# Altium schematic sheet Sheet1.SchDoc
size A3
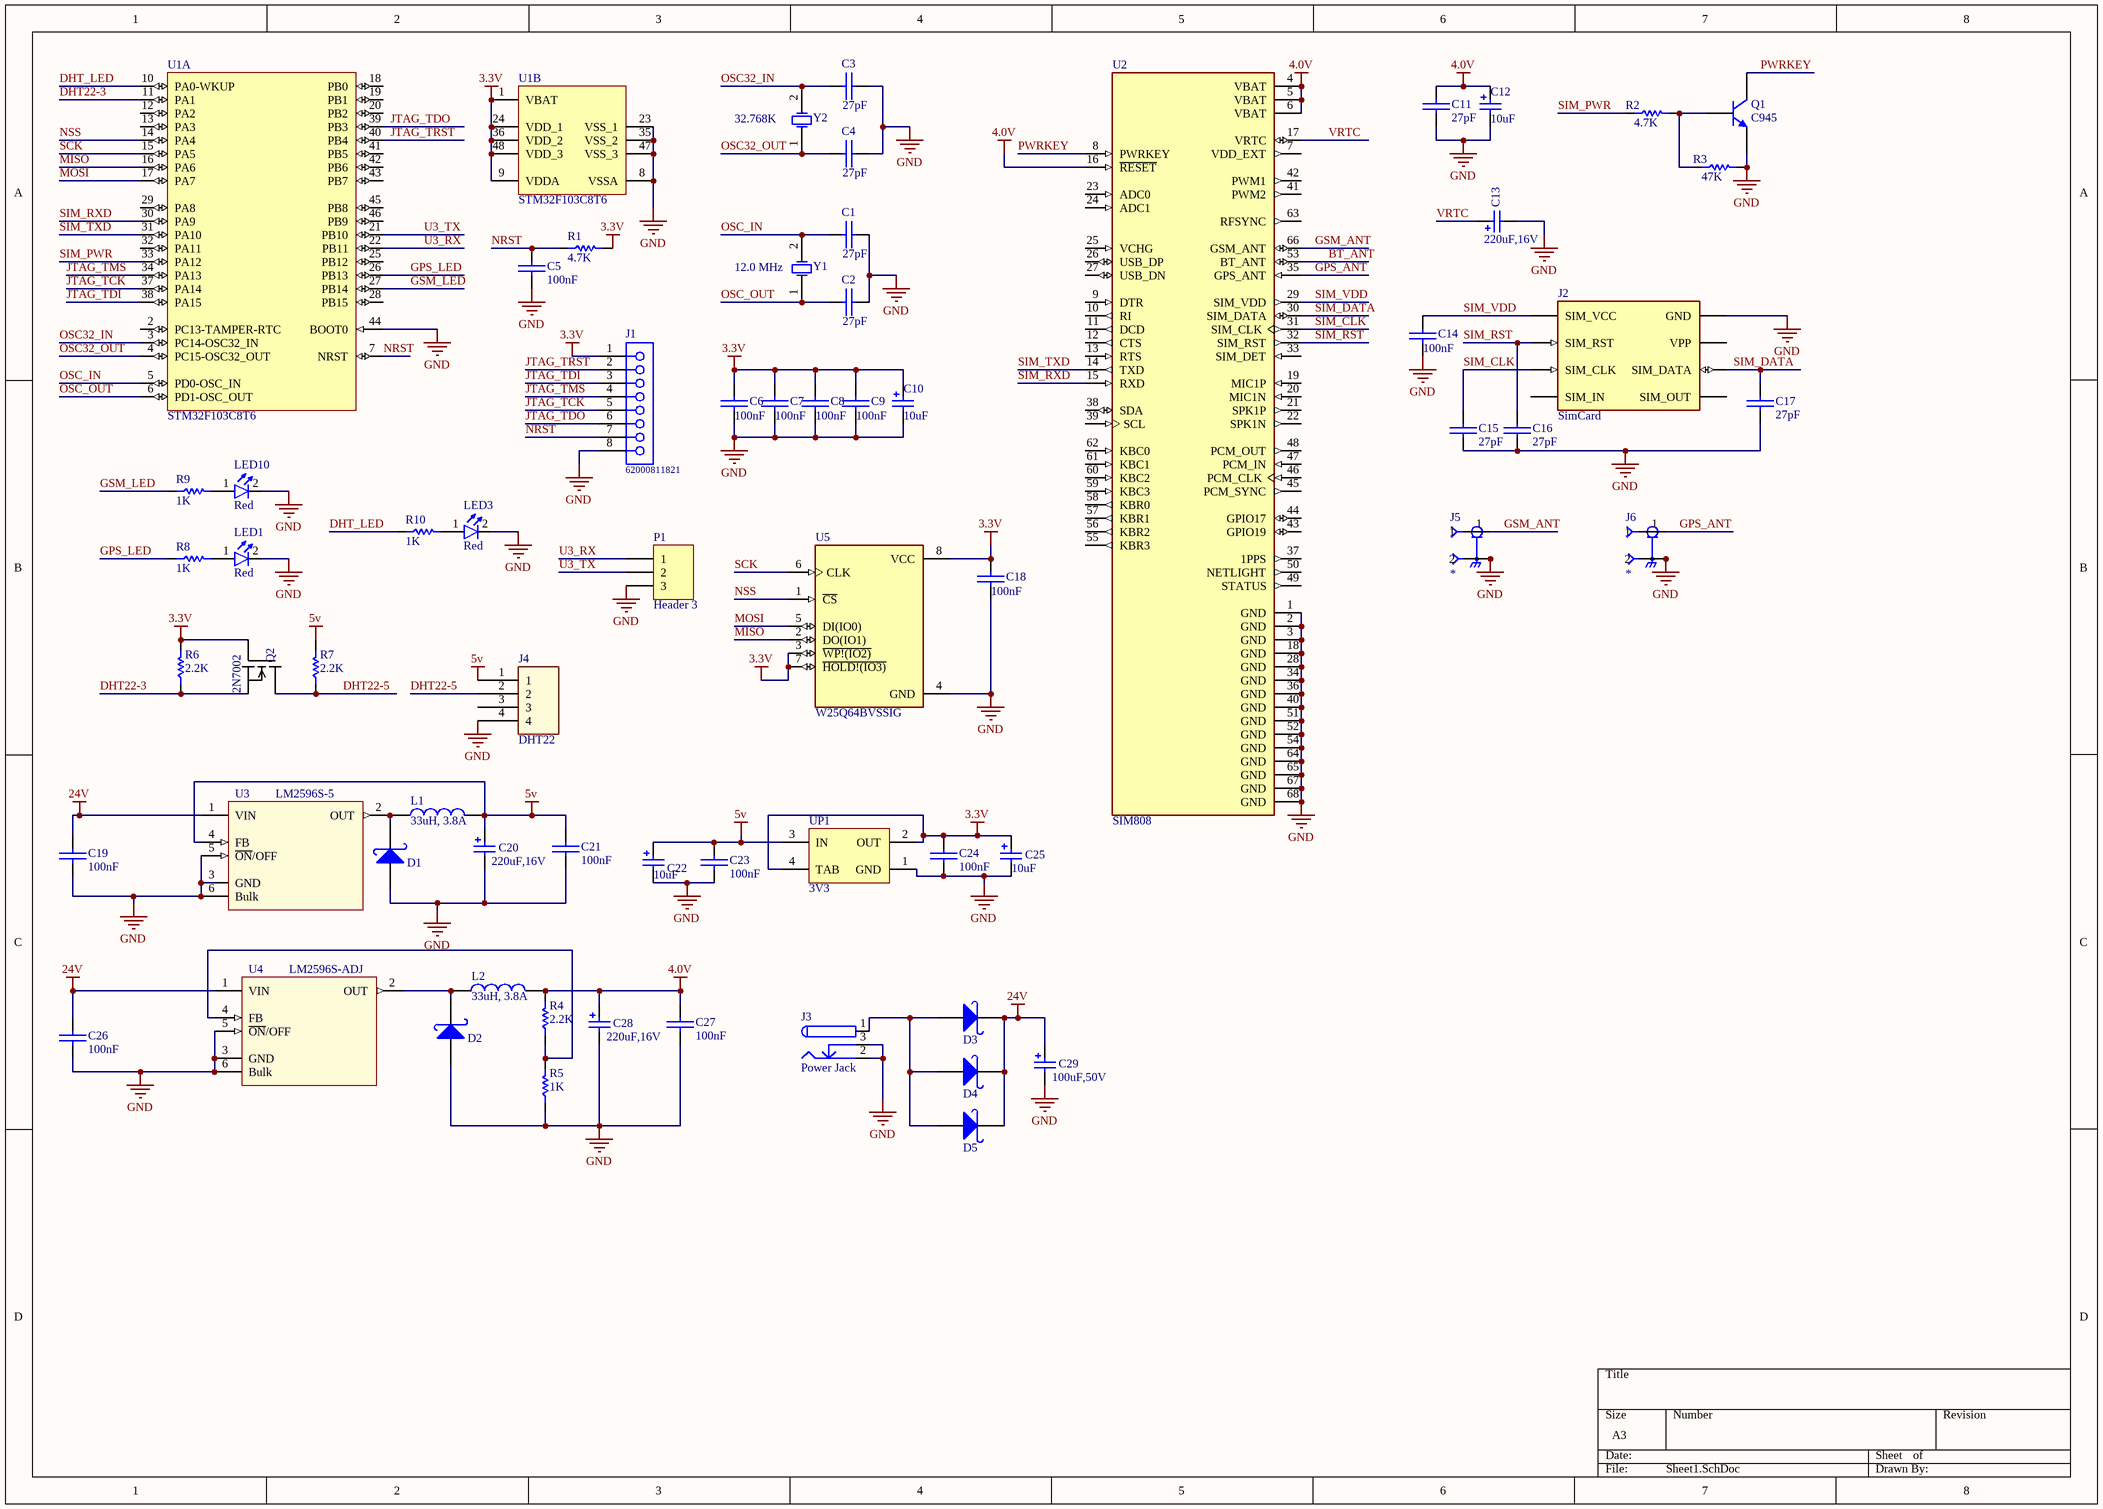
[diagram p0: Sheet1.SchDoc]

## Parts
C1  27pF  [SMD_CAP_0805]
C2  27pF  [SMD_CAP_0805]
C3  27pF  [SMD_CAP_0805]
C4  27pF  [SMD_CAP_0805]
C5  100nF  [SMD_CAP_0805]
C6  100nF  [SMD_CAP_0805]
C7  100nF  [SMD_CAP_0805]
C8  100nF  [SMD_CAP_0805]
C9  100nF  [SMD_CAP_0805]
C10  10uF  [WCAP-AS5H_4x5.5]
C11  27pF  [SMD_CAP_0805]
C12  10uF  [WCAP-AS5H_4x5.5]
C13  220uF,16V  [WCAP-AS5H_6.3x7.7]
C14  100nF  [SMD_CAP_0805]
C15  27pF  [SMD_CAP_0805]
C16  27pF  [SMD_CAP_0805]
C17  27pF  [SMD_CAP_0805]
C18  100nF  [SMD_CAP_0805]
C19  100nF  [SMD_CAP_0805]
C20  220uF,16V  [WCAP-AS5H_6.3x7.7]
C21  100nF  [SMD_CAP_0805]
C22  10uF  [WCAP-AS5H_4x5.5]
C23  100nF  [SMD_CAP_0805]
C24  100nF  [SMD_CAP_0805]
C25  10uF  [WCAP-AS5H_4x5.5]
C26  100nF  [SMD_CAP_0805]
C27  100nF  [SMD_CAP_0805]
C28  220uF,16V  [WCAP-AS5H_6.3x7.7]
C29  100uF,50V  [WCAP-AS5H_8x10.5]
D1  1n5822  [Diode 1N4007 SMD]  (value not drawn)
D2  1n5822  [Diode 1N4007 SMD]  (value not drawn)
D3  1n5822  [Diode 1N4007 SMD]  (value not drawn)
D4  1n5822  [Diode 1N4007 SMD]  (value not drawn)
D5  1n5822  [Diode 1N4007 SMD]  (value not drawn)
J1  62000811821  [62000811821]
J2  SimCard  [SImCArd]
J3  Power Jack  [Power Jack]
J4  DHT22  [XH-12-Right]
J5  221790-1  [TE_221790-1]  (value not drawn)
J6  221790-1  [TE_221790-1]  (value not drawn)
L1  33uH, 3.8A  [WE-PD_1210]
L2  33uH, 3.8A  [WE-PD_1210]
LED1  Red  [LED-3mm]
LED3  Red  [LED-3mm]
LED10  Red  [LED-3mm]
P1  Header 3  [HDR1X3]
Q1  C945  [SOT23_N]
Q2  2N7002  [*SOT23]
R1  4.7K  [RES 0805 (2012X06L)]
R2  4.7K  [RES 0805 (2012X06L)]
R3  47K  [RES 0805 (2012X06L)]
R4  2.2K  [RES 0805 (2012X06L)]
R5  1K  [RES 0805 (2012X06L)]
R6  2.2K  [RES 0805 (2012X06L)]
R7  2.2K  [RES 0805 (2012X06L)]
R8  1K  [RES 0805 (2012X06L)]
R9  1K  [RES 0805 (2012X06L)]
R10  1K  [RES 0805 (2012X06L)]
U1  STM32F103C8T6  [STM-LQFP48_N]  (parts A,B of 2)
U2  SIM808  [XCVR_SIM808]
U3  LM2596S-5  [*TO170P1435X465-6N]
U4  LM2596S-ADJ  [*TO170P1435X465-6N]
U5  W25Q64BVSSIG  [SOIC127P790X216-8N]
UP1  3V3  [SOT223]
Y1  12.0 MHz  [Crystal SMD]
Y2  32.768K  [XTAL RTC]

## Nets
3.3V: C6.1(+) C7.1(+) C8.1(+) C9.1(+) C10.2(P) C18.1(+) C24.1(+) C25.2(P) J1.1 Q2.1(G) R1.2 R6.2 U1.1(VBAT) U1.9(VDDA) U1.24(VDD_1) U1.36(VDD_2) U1.48(VDD_3) U5.3(~{WP!(IO2)}) U5.7(~{HOLD!(IO3)}) U5.8(VCC) UP1.2(OUT) UP1.4(TAB)
4.0V: C11.2(-) C12.2(P) C27.1(+) C28.2(P) L2.2 R4.2 U2.4(VBAT) U2.5(VBAT) U2.6(VBAT) U2.16(~{RESET})
5v: C20.2(P) C21.1(+) C22.2(P) C23.1(+) J4.1 L1.2 R7.2 U3.4(FB) UP1.3(IN)
24V: C19.1(+) C26.1(+) C29.2(P) D3.2(K) D4.2(K) D5.2(K) U3.1(VIN) U4.1(VIN)
GND: C1.2(-) C2.2(-) C3.2(-) C4.2(-) C5.2(-) C6.2(-) C7.2(-) C8.2(-) C9.2(-) C10.1(N) C11.1(+) C12.1(N) C13.1(N) C14.2(-) C15.1(+) C16.1(+) C17.1(+) C18.2(-) C19.2(-) C20.1(N) C21.2(-) C22.1(N) C23.2(-) C24.2(-) C25.1(N) C26.2(-) C27.2(-) C28.1(N) C29.1(N) D1.1(A) D2.1(A) J1.8 J2.C5(GND) J3.2 J3.3 J4.4 J5.2 J5.3 J5.4 J5.5 J6.2 J6.3 J6.4 J6.5 LED1.2(K) LED3.2(K) LED10.2(K) P1.3 Q1.2(E) R3.2 R5.1 U1.8(VSSA) U1.23(VSS_1) U1.35(VSS_2) U1.44(BOOT0) U1.47(VSS_3) U2.1(GND) U2.2(GND) U2.3(GND) U2.18(GND) U2.28(GND) U2.34(GND) U2.36(GND) U2.40(GND) U2.51(GND) U2.52(GND) U2.54(GND) U2.64(GND) U2.65(GND) U2.67(GND) U2.68(GND) U3.3(GND) U3.5(~{ON}/OFF) U3.6(Bulk) U4.3(GND) U4.5(~{ON}/OFF) U4.6(Bulk) U5.4(GND) UP1.1(GND)
BT_ANT: U2.53(BT_ANT)
DHT22-3: Q2.2(S) R6.1 U1.11(PA1)
DHT22-5: J4.2 Q2.3(D) R7.1
DHT_LED: R10.1 U1.10(PA0-WKUP)
GPS_ANT: J6.1 U2.35(GPS_ANT)
GPS_LED: R8.1 U1.26(PB13)
GSM_ANT: J5.1 U2.66(GSM_ANT)
GSM_LED: R9.1 U1.27(PB14)
JTAG_TCK: J1.5 U1.37(PA14)
JTAG_TDI: J1.3 U1.38(PA15)
JTAG_TDO: J1.6 U1.39(PB3)
JTAG_TMS: J1.4 U1.34(PA13)
JTAG_TRST: J1.2 U1.40(PB4)
MISO: U1.16(PA6) U5.2(DO(IO1))
MOSI: U1.17(PA7) U5.5(DI(IO0))
NRST: C5.1(+) J1.7 R1.1 U1.7(NRST)
NSS: U1.14(PA4) U5.1(~{CS})
OSC32_IN: C3.1(+) U1.3(PC14-OSC32_IN) Y2.2(OSC2)
OSC32_OUT: C4.1(+) U1.4(PC15-OSC32_OUT) Y2.1(OSC1)
OSC_IN: C1.1(+) U1.5(PD0-OSC_IN) Y1.2(OSC2)
OSC_OUT: C2.1(+) U1.6(PD1-OSC_OUT) Y1.1(OSC1)
PWRKEY: Q1.3(C) U2.8(PWRKEY)
SCK: U1.15(PA5) U5.6(CLK)
SIM_CLK: C15.2(-) J2.C3(SIM_CLK) U2.31(SIM_CLK)
SIM_DATA: C17.2(-) J2.C7(SIM_DATA) U2.30(SIM_DATA)
SIM_PWR: R2.1 U1.33(PA12)
SIM_RST: C16.2(-) J2.C2(SIM_RST) U2.32(SIM_RST)
SIM_RXD: U1.30(PA9) U2.15(RXD)
SIM_TXD: U1.31(PA10) U2.14(TXD)
SIM_VDD: C14.1(+) J2.C1(SIM_VCC) U2.29(SIM_VDD)
U3_RX: P1.1 U1.22(PB11)
U3_TX: P1.2 U1.21(PB10)
VRTC: C13.2(P) U2.17(VRTC)
NetD1_2: D1.2(K) L1.1 U3.2(OUT)
NetD2_2: D2.2(K) L2.1 U4.2(OUT)
NetD3_1: D3.1(A) D4.1(A) D5.1(A) J3.1
NetLED1_1: LED1.1(A) R8.2
NetLED3_1: LED3.1(A) R10.2
NetLED10_1: LED10.1(A) R9.2
NetQ1_1: Q1.1(B) R2.2 R3.1
NetR4_1: R4.1 R5.2 U4.4(FB)

Not connected (* = marked no-connect by the designer): J2 C4(SIM_IN) C6(VPP) C8(SIM_OUT); J4 3; U1 2(PC13-TAMPER-RTC) 12(PA2) 13(PA3) 18(PB0) 19(PB1) 20(PB2) 25(PB12) 28(PB15) 29(PA8) 32(PA11) 41(PB5) 42(PB6) 43(PB7) 45(PB8) 46(PB9); U2 7(VDD_EXT) 9(DTR) 10(RI) 11(DCD) 12(CTS) 13(RTS) 19(MIC1P) 20(MIC1N) 21(SPK1P) 22(SPK1N) 23(ADC0) 24(ADC1) 25(VCHG) 26(USB_DP) 27(USB_DN) 33(SIM_DET) 37(1PPS) 38(SDA) 39(SCL) 41(PWM2) 42(PWM1) 43(GPIO19) 44(GPIO17) 45(PCM_SYNC) 46(PCM_CLK) 47(PCM_IN) 48(PCM_OUT) 49(STATUS) 50(NETLIGHT) 55(KBR3) 56(KBR2) 57(KBR1) 58(KBR0) 59(KBC3) 60(KBC2) 61(KBC1) 62(KBC0) 63(RFSYNC)

## Library data of the parts
C1-C9 C11 C14-C19 C21 C23 C24 C26 C27 = Cap-Bipolar: Bipolar Capacitor; Voltage: 100V; Designer: Saeid Jorablo; Organazation: ControTec; Adding Date: 1387/12/20
  C1-C4 C11 C15-C17: Value: 27pF
  C5-C9 C14 C18 C19 C21 C23 C24 C26 C27: Value: 100nF
C10 C12 C22 C25 = 865230140001: WCAP-AS5H SMT Aluminum Electrolytic Capacitors, D4mm x L5.5mm, 22uF, +/-20%, 6.3VDC; Dissipation Factor: 32%; Endurance: 5000h; Leakage Current: 3uA; Ripple Current max.: 22mA; Technical Reference: ASDB055220M6R3DVCTAE000; ComponentLink1Description: Manufacturer; ComponentLink1URL: http://www.we-online.de; ComponentLink2Description: Datasheet; ComponentLink2URL: https://katalog.we-online.com/pbs/datasheet/865230140001.pdf; Length: 5.5mm; Mounting Technology: SMT; Operating Temperature: -40 to +105degC; Packaging: Tape and Reel; Published Date: August 2019; Capacitance: 22uF; Diameter: 4mm; Part Number: 865230140001; Publisher: Wurth Elektronik; Capacitance Tolerance: +/-20%; Rated Voltage: 6.3VDC
C13 C20 C28 = 865230345005: WCAP-AS5H SMT Aluminum Electrolytic Capacitors, D6.3mm x L7.7mm, 100uF, +/-20%, 16VDC; Dissipation Factor: 22%; Endurance: 5000h; Leakage Current: 16uA; Ripple Current max.: 81mA; Technical Reference: ASDD077101M016DVCTCE000; ComponentLink1Description: Manufacturer; ComponentLink1URL: http://www.we-online.de; ComponentLink2Description: Datasheet; ComponentLink2URL: https://katalog.we-online.com/pbs/datasheet/865230345005.pdf; Length: 7.7mm; Mounting Technology: SMT; Operating Temperature: -40 to +105degC; Packaging: Tape and Reel; Published Date: August 2019; Capacitance: 100uF; Diameter: 6.3mm; Part Number: 865230345005; Publisher: Wurth Elektronik; Capacitance Tolerance: +/-20%; Rated Voltage: 16VDC
C29 = 865230653012: WCAP-AS5H SMT Aluminum Electrolytic Capacitors, D8mm x L10.5mm, 47uF, +/-20%, 50VDC; Dissipation Factor: 12%; Endurance: 5000h; Leakage Current: 23.5uA; Ripple Current max.: 95mA; Technical Reference: ASDE105470M050DVCTEE000; ComponentLink1Description: Manufacturer; ComponentLink1URL: http://www.we-online.de; ComponentLink2Description: Datasheet; ComponentLink2URL: https://katalog.we-online.com/pbs/datasheet/865230653012.pdf; Length: 10.5mm; Mounting Technology: SMT; Operating Temperature: -40 to +105degC; Packaging: Tape and Reel; Published Date: August 2019; Capacitance: 47uF; Diameter: 8mm; Part Number: 865230653012; Publisher: Wurth Elektronik; Capacitance Tolerance: +/-20%; Rated Voltage: 50VDC
D1-D5 = 1N5822 SMD: Schottky Rectifiers; Part. No: SS34; Manufacturer: ON Semiconductor/Fairchild; Designer: Abbas Basereh; Link: https://www.aliexpress.com/item/Free-shipping-100pcs-1n5822-sma-smd-do-214ac-Schottky-diode-ss34/32337482329.html?spm=2114.01010208.3.1.zLZDsP&ws_ab_test=searchweb0_0,searchweb201602_4_10065_10068_10084_10083_10080_10082_10081_10060_10061_10062_10056_10055_10054_10059_10099_10078_10079_427_10073_10103_10102_10096_10052_10050_10051,searchweb201603_4&btsid=6e50dc92-ac69-45bc-a19e-209af19ce602; Link: http://www.tme.eu/en/details/ss34/smd-schottky-diodes/vishay/ss34-e357t/; Link: http://www.digikey.com/product-detail/en/on-semiconductor-fairchild/SS34/SS34FSCT-ND/2094459; Data: 16-12-2016
J1 = 62000811821: WR-PHD Socket Header, THT, pitch 2mm, Single Row, Vertical, 8pin; Pin Number: 8; Gender: Female; Rated Current: 2A; Working Voltage: 250VAC; Withstanding Voltage: 500VAC; Contact Resistance: 20mOhm; ComponentLink1Description: Manufacturer; ComponentLink1URL: http://www.we-online.de; ComponentLink2Description: Datasheet; ComponentLink2URL: https://katalog.we-online.de/em/datasheet/62000811821.pdf; Part Number: 62000811821; Published Date: June 2019; Publisher: Wurth Elektronik; Pitch: 2mm; Operating Temperature: -40 to +105degC; Mounting Technology: THT; Packaging: Tube; Row Number: Single; Orientation: Vertical
J3 = Power Jack: Designer: Saeid Jorablo; Company: Personal; Project Name: Laser; Adding Date: 10/21/2009
J4 = XH-Connector-4pin-right
J5 J6 = 221790-1: Connector; SMA; PCB; Right Angle; Stainless Steel; 0.6 in.; Beryllium Copper; Number_of_Positions: 1; MF: TE Connectivity; Price: None; EU_RoHS_Compliance: Compliant with Exemptions; Package: None; TE_purchase_URL: https://www.te.com/usa-en/product-221790-1.html?te_bu=Cor&te_type=disp&te_campaign=seda_glo_cor-seda-global-disp-prtnr-fy19-seda-model-bom-cta_sma-317_1&elqCampaignId=32493; MP: 221790-1; Value: *; Availability: Unavailable; SnapEDA_Link: https://www.snapeda.com/parts/221790-1/TE%20Connectivity%20AMP%20Connectors/view-part/496294/?ref=snap; Comment_1: *
L1 L2 = 7447709470: WE-PD SMT Power Inductor, size 1210, 47uH, 3.8A; DC Resistance max.: 60mOhm; Self Resonant Frequency: 6.5MHz; Saturation Current: 4.5A; ComponentLink1Description: Manufacturer; ComponentLink1URL: http://www.we-online.de; ComponentLink2Description: Datasheet; ComponentLink2URL: https://katalog.we-online.com/pbs/datasheet/7447709470.pdf; Part Number: 7447709470; Published Date: April 2019; Publisher: Wurth Elektronik; Rated Current: 3.8A; Size: 1210; Inductance: 47uH; Operating Temperature: -40 to +125degC; Mounting Technology: SMT; Packaging: Tape and Reel; Value: 33uH, 3.8A
LED1 LED3 LED10 = LED: Designer: Saeid Jorablo; Organazation: ControTec; Adding Date: 1387/12/22; Color: Red; Size: SMD 1206
P1 = Header 3: Header, 3-Pin; LatestRevisionDate: 17-Jul-2002; LatestRevisionNote: Re-released for DXP Platform.; Publisher: Altium Limited
Q1 = C945: NPN Silicon Epitaxial Planar Transistor; Published: 2017-2-8; LatestRevisionDate: 2017; LatestRevisionNote: IPC-7351 Footprint Added.; DatasheetVersion: 2017; PackageVersion: 2017-2-8; PackageReference: SOT23; Publisher: Abbas Basereh; PackageDescription: 3-Pin SOT-23 Package 0.95 mm Pitch, 2.3 mm Lead Span; ComponentLink1Description: Manufacturer Link; ComponentLink1URL: http://www.taitroncomponents.com/; ComponentLink2Description: Datasheet; ComponentLink2URL: http://www.taitroncomponents.com/
Q2 = 2N7002: Transistor NPN Mos 2N7002 SILICONIX miliampere=100 V=60 SOt23; MF: STMicroelectronics; Availability: Unavailable; SnapEDA_Link: https://www.snapeda.com/parts/2N7002/STMicroelectronics/view-part/?ref=snap; Price: None; Package: SOT-23-3 Vishay; MP: 2N7002; Value: *
R1-R10 = Resistor: Tolerance: 5%; Power: 1/8 W
  R1 R2: Value: 4.7K
  R3: Value: 47K
  R4 R6 R7: Value: 2.2K
  R5 R8-R10: Value: 1K
U1 = STM32F103C8T6: ARM Cortex-M3 32-bit MCU, 64 KB Flash, 20 KB Internal RAM, 37 I/Os, 48-pin LQFP, -40 to 85 degC, Tray; A/D Converter: 2x12-bit (10 Channel); FLASH Size (Prog) (kB): 64; I/Os (High Current): 37; Internal RAM Size (kB): 20; Operating Frequency(F) (Processor speed) (MHz): 72; Supply Voltage(Vcc) min (V): 2; DatasheetVersion: Rev. 16; PackageVersion: Rev. 6, 06/2013; PackageReference: LQFP48; PackageDescription: 48-Pin Low Profile Quad Flat Package, 7 x 7 mm Body, 0.5 mm Pitch; Supplier 1: Digi-Key; Supplier Part Number 1: 497-6063-ND; Supplier 2: Farnell; Supplier Part Number 2: 1447637; Supplier 3: Newark; Supplier Part Number 3: 59M2182; Supplier 4: Newark; Supplier Part Number 4: 57P1222; Supplier 5: Mouser; Supplier Part Number 5: 511-STM32F103C8T6; Core: ARM Cortex-M3; Packing: Tray; Mounting Technology: Surface Mount; PartNumber: STM32F103C8T6; ComponentLink1Description: Manufacturer URL; ComponentLink1URL: http://www.st.com/web/en/home.html; ComponentLink2Description: Datasheet; ComponentLink2URL: http://www.st.com/st-web-ui/static/active/en/resource/technical/document/datasheet/CD00161566.pdf; ComponentLink3Description: Package Specification; ComponentLink3URL: http://www.st.com/st-web-ui/static/active/en/resource/technical/document/datasheet/DM00058181.pdf
U2 = SIM808: SIM808 GPS, GPRS/GSM RF Arduino Platform Evaluation Expansion Board; MF: Adafruit Industries; MP: SIM808; Package: None; SnapEDA_Link: https://www.snapeda.com/parts/SIM808/SIMcom%20Wireless%20solutions%20Co.%2CLtd/view-part/424834/?ref=snap; Availability: Unavailable; Price: None; Value: *
U3 = LM2596S-3.3: MF: Texas Instruments; SnapEDA_Link: https://www.snapeda.com/parts/LM2596S-3.3/Texas%20Instruments/view-part/?ref=snap; Availability: Unavailable; MP: LM2596S-5; Price: None; Package: TO-263-6 HTC Korea; Value: *
U4 = LM2596S-3.3: MP: LM2596S-5; MF: Texas Instruments; SnapEDA_Link: https://www.snapeda.com/parts/LM2596S-3.3/Texas%20Instruments/view-part/?ref=snap; Availability: Unavailable; Price: None; Package: TO-263-6 HTC Korea; Value: *
U5 = W25Q64BVSSIG: FLASH - NOR Memory IC 64Mb _8M x 8_ SPI 80MHz 8-SOIC; MF: Winbond Electronics; MP: W25Q64BVSSIG; Package: SOIC-8 Winbond; Price: None; Availability: Unavailable; Value: *; SnapEDA_Link: https://www.snapeda.com/parts/W25Q64BVSSIG/Winbond%20Electronics/view-part/261027/?ref=snap
UP1 = AMS1117-x.x: x.x Volt, 800mA Low-Dropout Linear Regulator, 4-pin SOT-223; Designer: Ali Hafizi; Data: 16-12-2016
Y1 Y2 = XTAL: XTAL Crystal; Company: E.P.I.L; Design Date: 11/04/2011
  Y1: Value: 12.0 MHz
  Y2: Value: 32.768K